# EAGLE design cdz7shld1 (EAGLE 9.6.2)

## Sheet 1 of 2
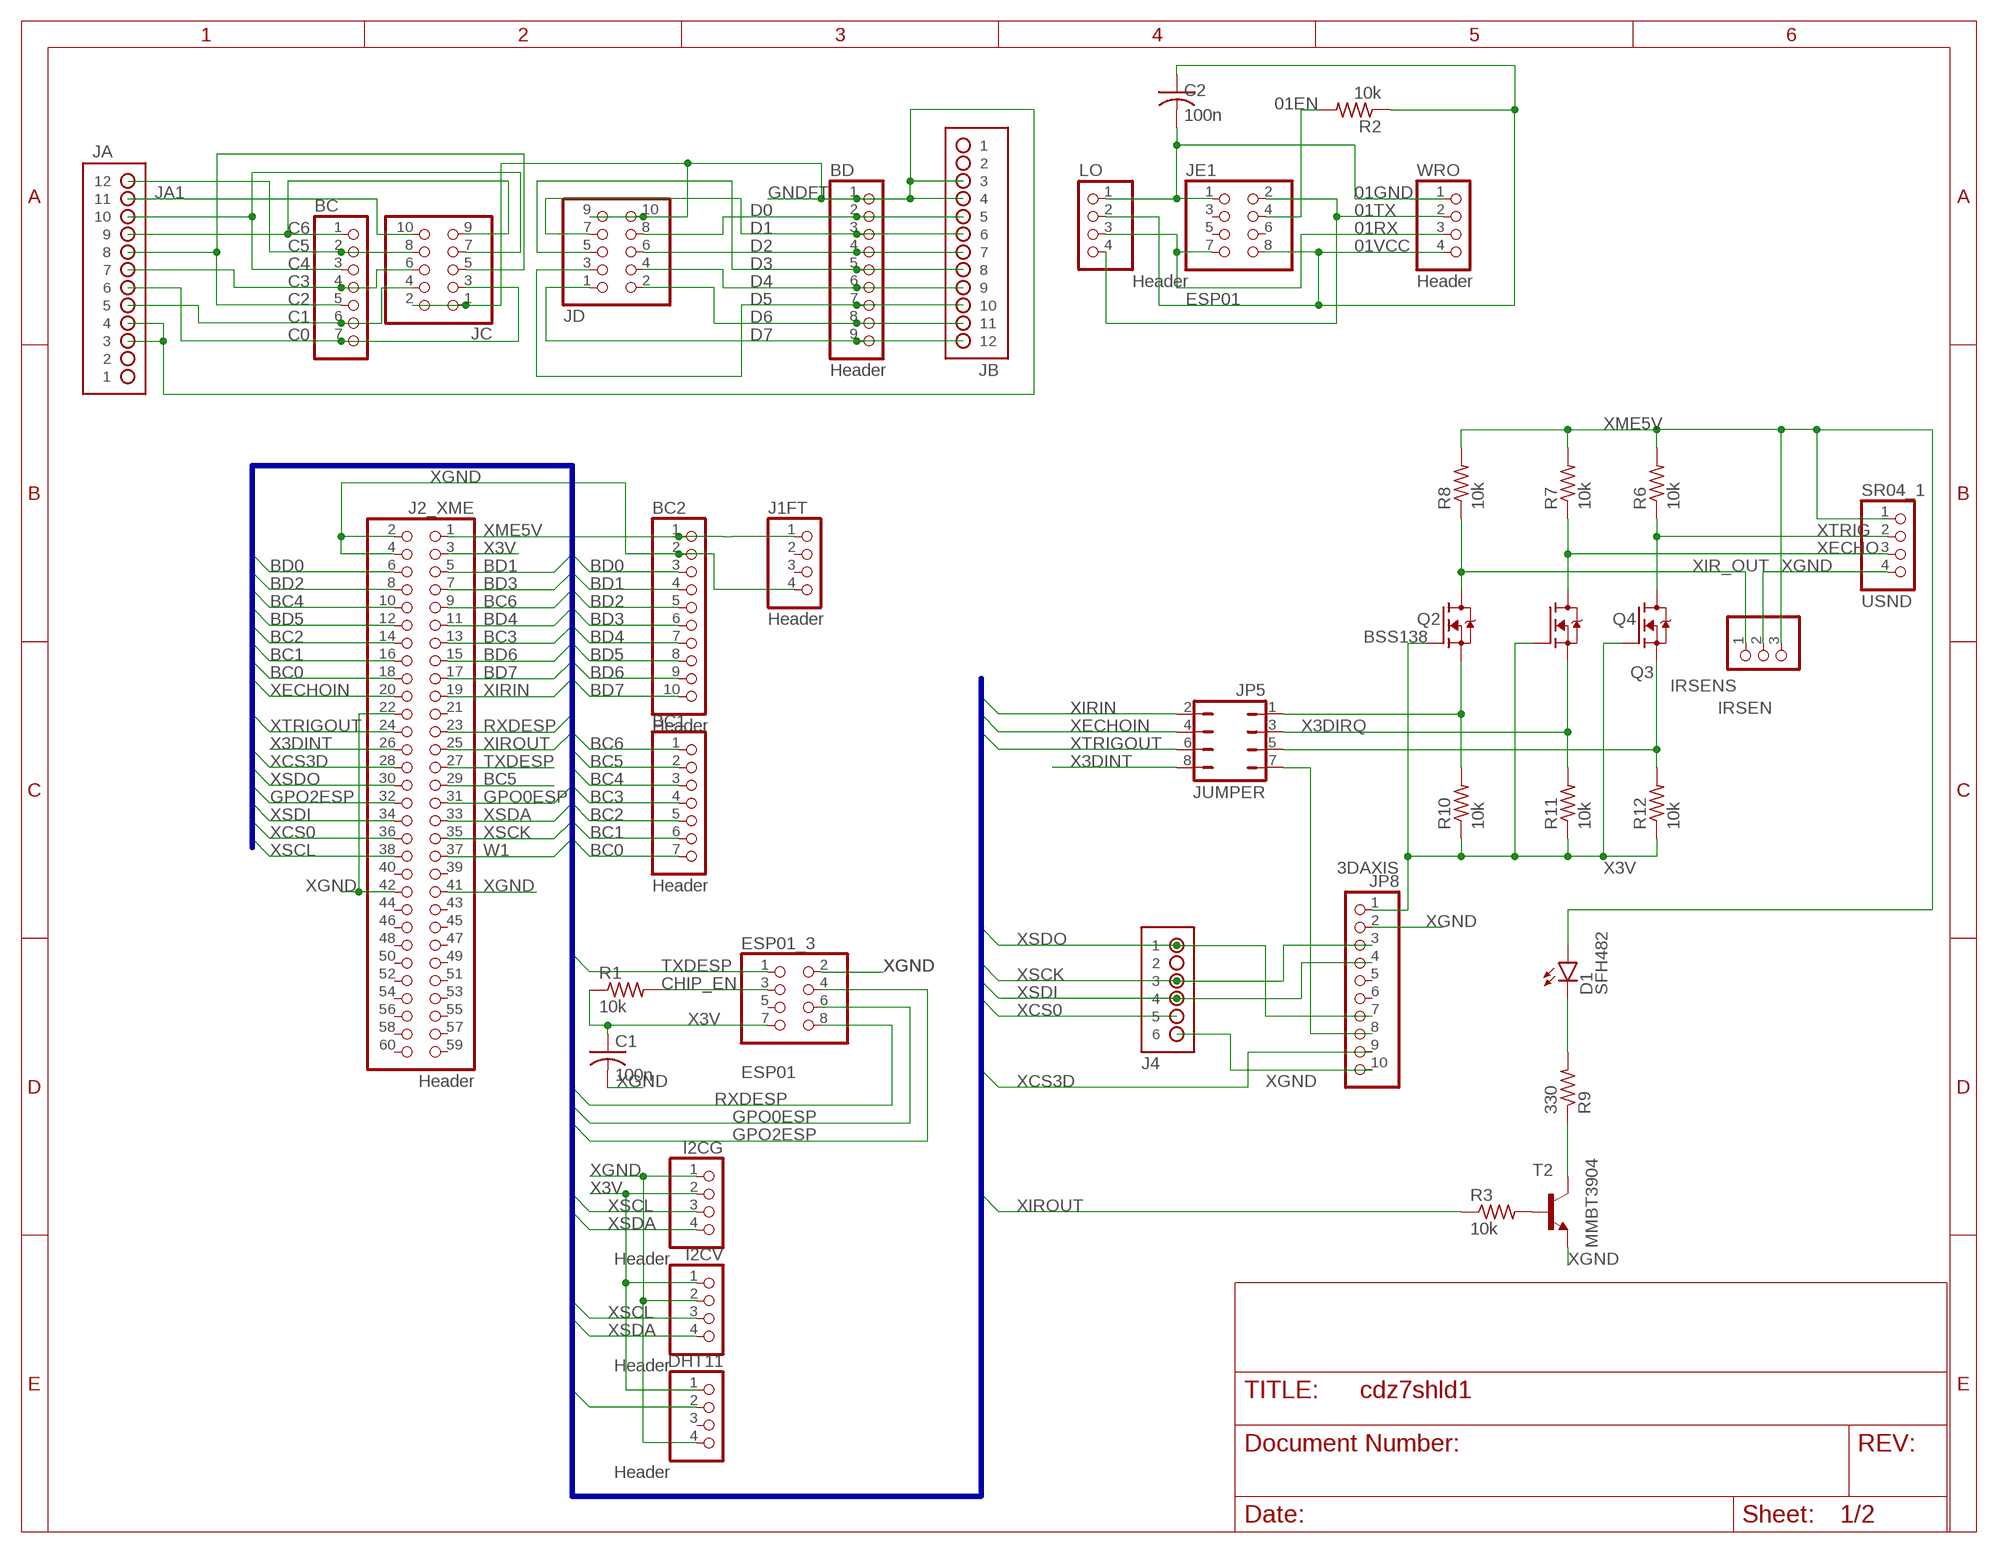
[diagram p0: schematic, sheet 1]

### Parts
BC  Header  PINHD-1X7  [1X07]
BC1  Header  PINHD-1X7  [1X07]
BC2  Header  PINHD-1X10  [1X10]
BD  Header  PINHD-1X9  [1X09]
C1  100n  C-USC0402  [C0402]
C2  100n  C-USC0402  [C0402]
D1  SFH482  [SFH482]
DHT11  Header  PINHD-1X4  [1X04]
ESP01_3  ESP01  PINHD-2X4  [2X04]
I2CG  Header  PINHD-1X4  [1X04]
I2CV  Header  PINHD-1X4  [1X04]
IRSENS  IRSEN  PINHD-1X3  [1X03]
J1FT  Header  PINHD-1X4  [1X04]
J2_XME  Header  PINHD-2X30  [2X30]
J4  HDR-2X3  [HDR-2X3]
JA  HDR-2X6  [HDR-2X6]
JB  HDR-2X6  [HDR-2X6]
JC  Header  PINHD-2X5  [2X05]
JD  Header  PINHD-2X5  [2X05]
JE1  ESP01  PINHD-2X4  [2X04]
JP5  JUMPER  JP4Q  [JP4Q]
JP8  3DAXIS  PINHD-1X10  [1X10]
LO  Header  PINHD-1X4  [1X04]
Q2  BSS138  [SOT23]
Q3  BSS138  [SOT23]
Q4  BSS138  [SOT23]
R1  10k  R-US_R0402  [R0402]
R2  10k  R-US_R0402  [R0402]
R3  10k  R-US_R0402  [R0402]
R6  10k  R-US_R0402  [R0402]
R7  10k  R-US_R0402  [R0402]
R8  10k  R-US_R0402  [R0402]
R9  330  R-US_R0402  [R0402]
R10  10k  R-US_R0402  [R0402]
R11  10k  R-US_R0402  [R0402]
R12  10k  R-US_R0402  [R0402]
SR04_1  USND  PINHD-1X4  [1X04]
T2  MMBT3904  MMBT3904LT1-NPN-SOT23-BEC  [SOT23-BEC]
WRO  Header  PINHD-1X4  [1X04]

### Nets
01EN: JE1.4 R2.2
01GND: C2.2 JE1.1 LO.1 WRO.1
01RX: JE1.7 LO.3 WRO.3
01TX: JE1.2 LO.4 WRO.2
01VCC: C2.1 JE1.8 LO.2 R2.1 WRO.4
BC0: BC1.7 J2_XME.18
BC1: BC1.6 J2_XME.16
BC2: BC1.5 J2_XME.14
BC3: BC1.4 J2_XME.13
BC4: BC1.3 J2_XME.10
BC5: BC1.2 J2_XME.29
BC6: BC1.1 J2_XME.9
BD0: BC2.3 J2_XME.6
BD1: BC2.4 J2_XME.5
BD2: BC2.5 J2_XME.8
BD3: BC2.6 J2_XME.7
BD4: BC2.7 J2_XME.11
BD5: BC2.8 J2_XME.12
BD6: BC2.9 J2_XME.15
BD7: BC2.10 J2_XME.17
C0: BC.7 JA.6 JC.3
C1: BC.6 JA.5 JC.4
C2: BC.5 JA.8 JC.5
C3: BC.4 JA.7 JC.6
C4: BC.3 JA.10 JC.7
C5: BC.2 JA.12 JC.8
C6: BC.1 JA.9 JC.9
CHIP_EN: ESP01_3.3 R1.2
D0: BD.2 JB.5 JD.8
D1: BD.3 JB.6 JD.7
D2: BD.4 JB.7 JD.6
D3: BD.5 JB.8 JD.5
D4: BD.6 JB.9 JD.4
D5: BD.7 JB.10 JD.3
D6: BD.8 JB.11 JD.2
D7: BD.9 JB.12 JD.1
GNDFT: BD.1 JA.3 JA.4 JB.3 JB.4 JC.1 JC.2 JD.9 JD.10
GPO0ESP: ESP01_3.6 J2_XME.31
GPO2ESP: ESP01_3.4 J2_XME.32
JA1: JA.11 JC.10
N$1: D1.K(C) R9.2
N$2: JP5.1 Q2.2(S) R10.2
N$4: R3.2 T2.B
N$11: JP5.3 Q3.2(S) R11.2
N$12: JP5.5 Q4.2(S) R12.2
N$17: R9.1 T2.C
RXDESP: ESP01_3.8 J2_XME.23
TXDESP: ESP01_3.1 J2_XME.27
W1: DHT11.2 J2_XME.37
X3DINT: J2_XME.26 JP5.8
X3DIRQ: JP5.7 JP8.8
X3V: C1.1 DHT11.1 ESP01_3.7 I2CG.2 I2CV.1 J2_XME.3 JP8.1 Q2.1(G) Q3.1(G) Q4.1(G) R1.1 R10.1 R11.1 R12.1
XCS0: J2_XME.36 J4.5
XCS3D: J2_XME.28 JP8.9
XECHO: Q3.3(D) R7.1 SR04_1.3
XECHOIN: J2_XME.20 JP5.4
XGND: BC2.2 C1.2 DHT11.4 ESP01_3.2 I2CG.1 I2CV.2 IRSENS.2 J1FT.4 J2_XME.2 J2_XME.4 J2_XME.22 J2_XME.41 J2_XME.42 J4.6 JP8.2 JP8.10 SR04_1.4 T2.E
XIR_OUT: IRSENS.1 Q2.3(D) R8.1
XIRIN: J2_XME.19 JP5.2
XIROUT: J2_XME.25 R3.1
XME5V: BC2.1 D1.A IRSENS.3 J1FT.1 J2_XME.1 R6.2 R7.2 R8.2 SR04_1.1
XSCK: J2_XME.35 J4.3 JP8.3
XSCL: I2CG.3 I2CV.3 J2_XME.38
XSDA: I2CG.4 I2CV.4 J2_XME.33
XSDI: J2_XME.34 J4.4 JP8.4
XSDO: J2_XME.30 J4.1 JP8.7
XTRIG: Q4.3(D) R6.1 SR04_1.2
XTRIGOUT: J2_XME.24 JP5.6
Unconnected: DHT11.3 ESP01_3.5 J1FT.2 J1FT.3 J2_XME.21 J2_XME.39 J2_XME.40 J2_XME.43 J2_XME.44 J2_XME.45 J2_XME.46 J2_XME.47 J2_XME.48 J2_XME.49 J2_XME.50 J2_XME.51 J2_XME.52 J2_XME.53 J2_XME.54 J2_XME.55 J2_XME.56 J2_XME.57 J2_XME.58 J2_XME.59 J2_XME.60 J4.2 JA.1 JA.2 JB.1 JB.2 JE1.3 JE1.5 JE1.6 JP8.5 JP8.6

### Buses
BC[0..6],BD[0..7],GPO0ESP,GPO2ESP,RXDESP,SCL,TXDESP,W1,XCS0,XCS3D,XECHOIN,XIRIN,XIROUT,XSCK,XSCL,XSDA,XSDI,XSDO,XTRIGOUT

## Sheet 2 of 2
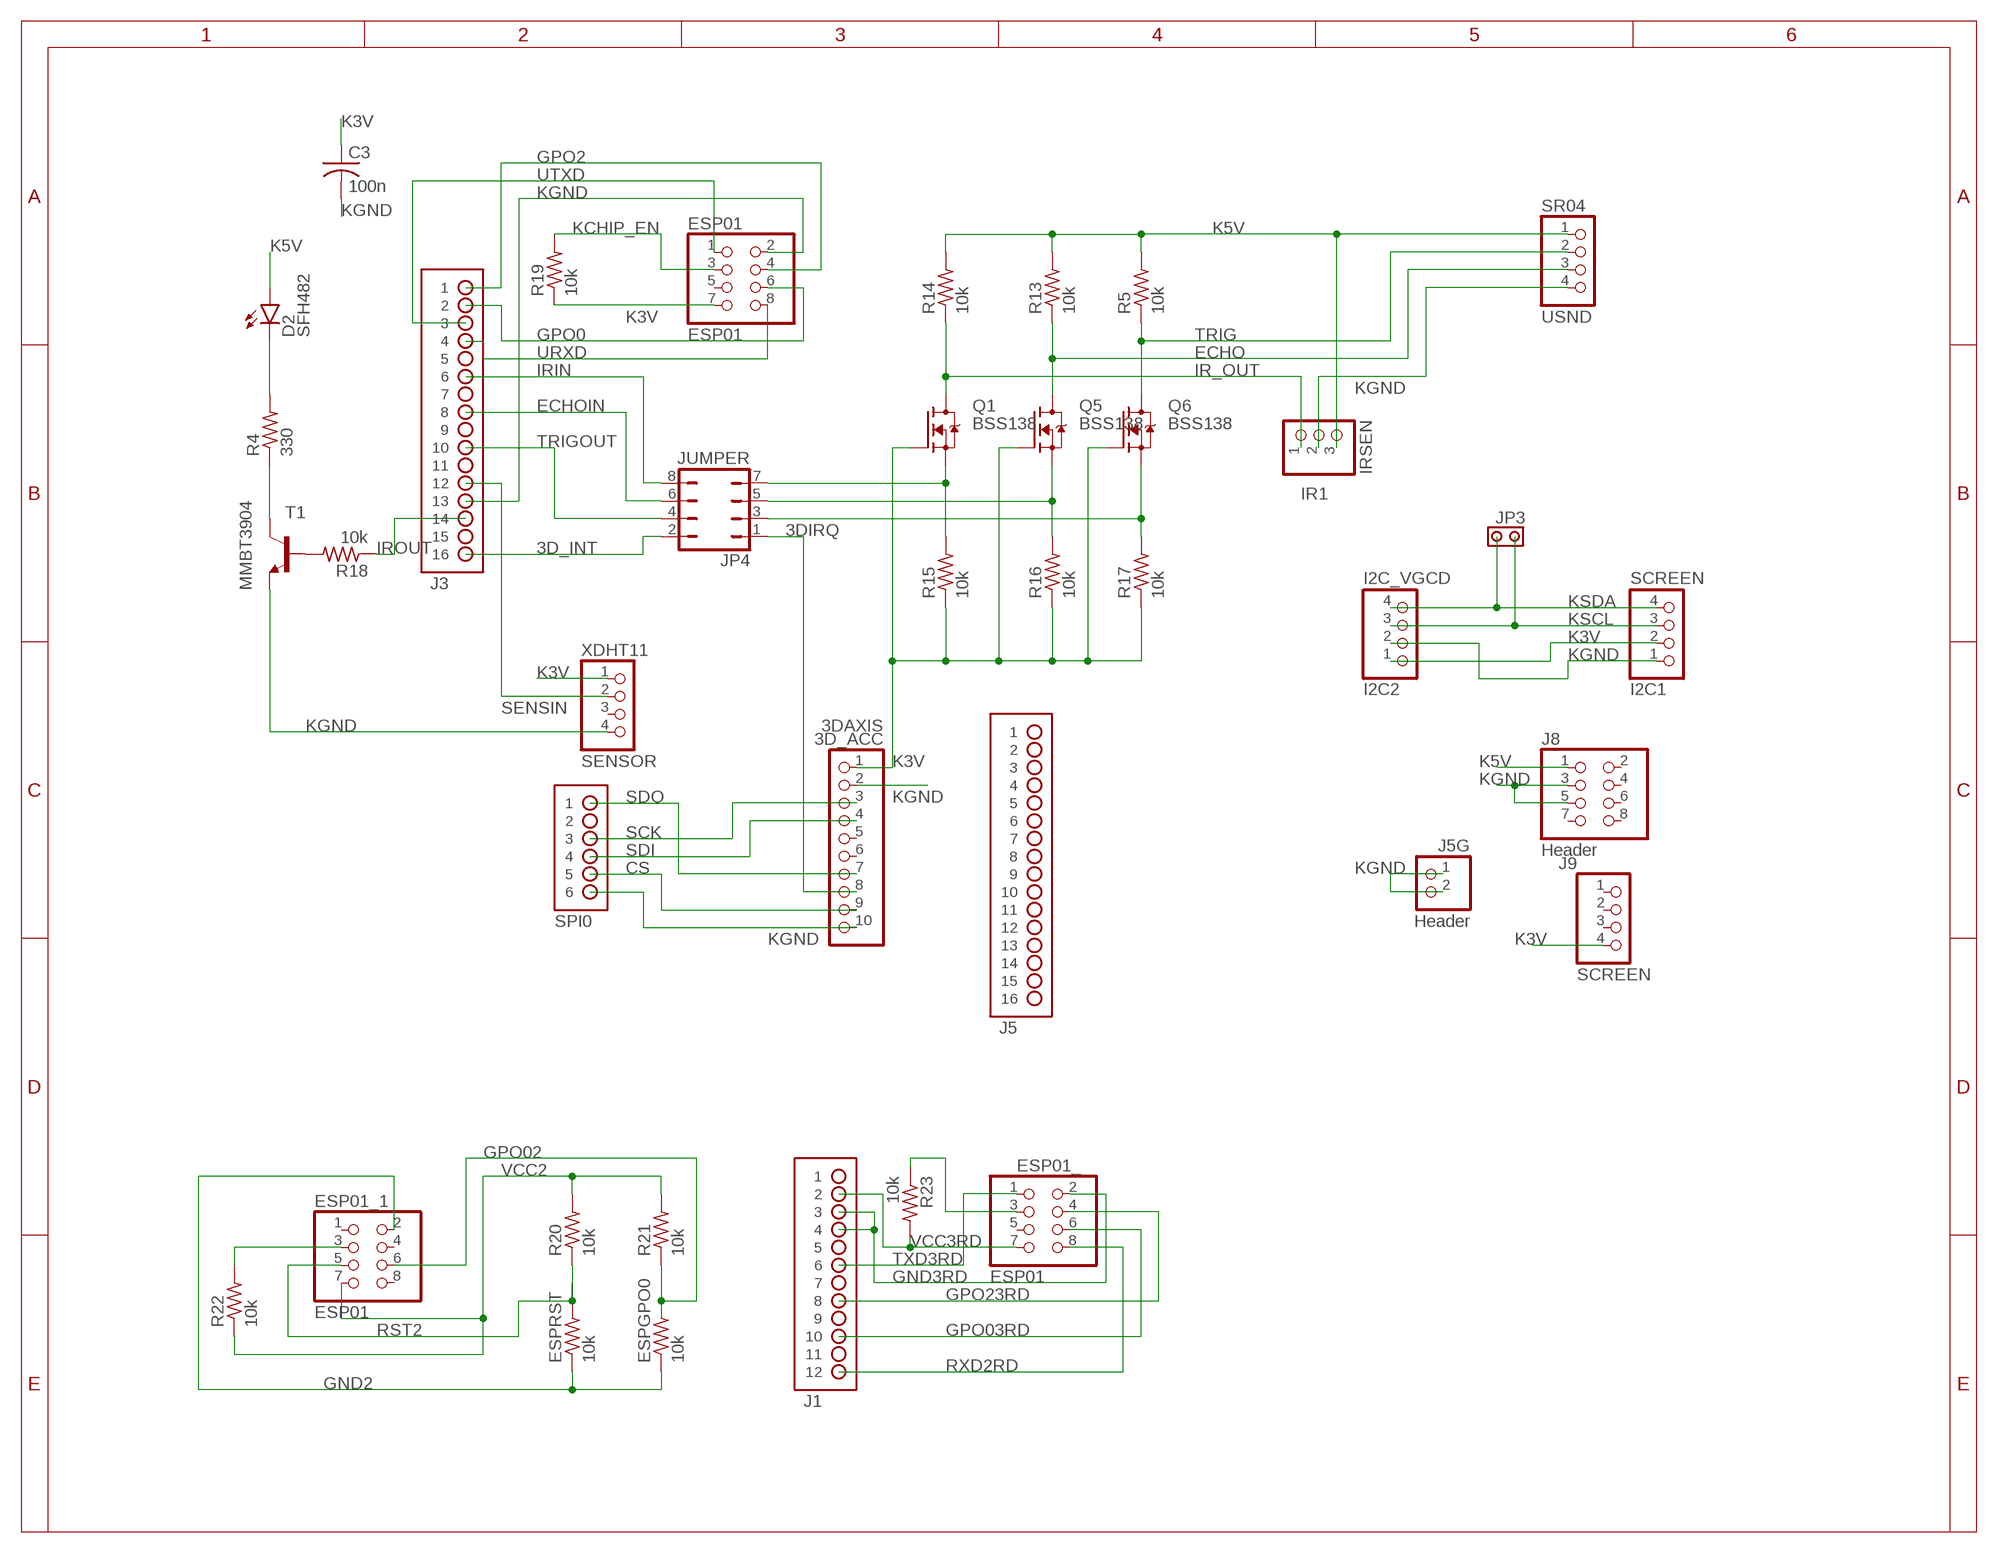
[diagram p1: schematic, sheet 2]

### Parts
3D_ACC  3DAXIS  PINHD-1X10  [1X10]
C3  100n  C-USC0402  [C0402]
D2  SFH482  [SFH482]
ESP01  ESP01  PINHD-2X4  [2X04]
ESP01_  ESP01  PINHD-2X4  [2X04]
ESP01_1  ESP01  PINHD-2X4  [2X04]
ESPGPO0  10k  R-US_0204/5  [0204/5]
ESPRST  10k  R-US_0204/5  [0204/5]
I2C1  SCREEN  PINHD-1X4  [1X04]
I2C2  I2C_VGCD  PINHD-1X4  [1X04]
IR1  IRSEN  PINHD-1X3  [1X03]
J1  HDR-2X6  [HDR-2X6]
J3  HDR-2X8  [HDR-2X8]
J5  HDR-2X8  [HDR-2X8]
J5G  Header  PINHD-1X2  [1X02]
J8  Header  PINHD-2X4  [2X04]
J9  SCREEN  PINHD-1X4  [1X04]
JP3  JPR-1X2  [JPR-1X2]
JP4  JUMPER  JP4Q  [JP4Q]
Q1  BSS138  [SOT23]
Q5  BSS138  [SOT23]
Q6  BSS138  [SOT23]
R4  330  R-US_R0402  [R0402]
R5  10k  R-US_R0402  [R0402]
R13  10k  R-US_R0402  [R0402]
R14  10k  R-US_R0402  [R0402]
R15  10k  R-US_R0402  [R0402]
R16  10k  R-US_R0402  [R0402]
R17  10k  R-US_R0402  [R0402]
R18  10k  R-US_R0402  [R0402]
R19  10k  R-US_R0402  [R0402]
R20  10k  R-US_R0402  [R0402]
R21  10k  R-US_R0402  [R0402]
R22  10k  R-US_R0402  [R0402]
R23  10k  R-US_R0402  [R0402]
SPI0  HDR-2X3  [HDR-2X3]
SR04  USND  PINHD-1X4  [1X04]
T1  MMBT3904  MMBT3904LT1-NPN-SOT23-BEC  [SOT23-BEC]
XDHT11  SENSOR  PINHD-1X4  [1X04]

### Nets
3D_INT: J3.16 JP4.2
3DIRQ: 3D_ACC.8 JP4.1
CS: 3D_ACC.9 SPI0.5
ECHO: Q5.3(D) R13.1 SR04.3
ECHOIN: J3.8 JP4.6
GND2: ESP01_1.2 ESPGPO0.1 ESPRST.1
GND3RD: ESP01_.2 J1.3 J1.4
GPO0: ESP01.6 J3.2
GPO2: ESP01.4 J3.1
GPO02: ESP01_1.6 ESPGPO0.2 R21.1
GPO03RD: ESP01_.6 J1.10
GPO23RD: ESP01_.4 J1.8
IR_OUT: IR1.1 Q1.3(D) R14.1
IRIN: J3.6 JP4.8
IROUT: J3.14 R18.1
K3V: 3D_ACC.1 C3.1 ESP01.7 I2C1.2 I2C2.1 J9.4 Q1.1(G) Q5.1(G) Q6.1(G) R15.1 R16.1 R17.1 R19.1 XDHT11.1
K5V: D2.A IR1.3 J8.1 R5.2 R13.2 R14.2 SR04.1
KCHIP_EN: ESP01.3 R19.2
KGND: 3D_ACC.2 3D_ACC.10 C3.2 ESP01.2 I2C1.1 I2C2.2 IR1.2 J3.13 J5G.1 J5G.2 J8.3 J8.5 SPI0.6 SR04.4 T1.E XDHT11.4
KSCL: I2C1.3 I2C2.3 JP3.2
KSDA: I2C1.4 I2C2.4 JP3.1
N$3: R4.1 T1.C
N$5: D2.K(C) R4.2
N$6: JP4.5 Q5.2(S) R16.2
N$7: JP4.3 Q6.2(S) R17.2
N$8: JP4.7 Q1.2(S) R15.2
N$9: R18.2 T1.B
N$10: ESP01_1.3 R22.2
N$13: ESP01_.3 R23.1
RST2: ESP01_1.5 ESPRST.2 R20.1
RXD2RD: ESP01_.8 J1.12
SCK: 3D_ACC.3 SPI0.3
SDI: 3D_ACC.4 SPI0.4
SDO: 3D_ACC.7 SPI0.1
SENSIN: J3.12 XDHT11.2
TRIG: Q6.3(D) R5.1 SR04.2
TRIGOUT: J3.10 JP4.4
TXD3RD: ESP01_.1 J1.6
URXD: ESP01.8 J3.4
UTXD: ESP01.1 J3.3
VCC2: ESP01_1.7 R20.2 R21.2 R22.1
VCC3RD: ESP01_.7 J1.2 R23.2
Unconnected: 3D_ACC.5 3D_ACC.6 ESP01.5 ESP01_1.1 ESP01_1.4 ESP01_1.8 ESP01_.5 J1.1 J1.5 J1.7 J1.9 J1.11 J3.5 J3.7 J3.9 J3.11 J3.15 J5.1 J5.2 J5.3 J5.4 J5.5 J5.6 J5.7 J5.8 J5.9 J5.10 J5.11 J5.12 J5.13 J5.14 J5.15 J5.16 J8.2 J8.4 J8.6 J8.7 J8.8 J9.1 J9.2 J9.3 SPI0.2 XDHT11.3

## Library data of the parts
3D_ACC BC2 JP8 = pinhead2:PINHD-1X10: PIN HEADER
BC BC1 = pinhead2:PINHD-1X7: PIN HEADER
BD = pinhead2:PINHD-1X9: PIN HEADER
C1-C3 = rcl:C-US: CAPACITOR, American symbol; SPICEPREFIX: C
D1 D2 = led:SFH482: IR LED infrared emitting diode, Infineon
DHT11 I2C1 I2C2 I2CG I2CV J1FT J9 LO SR04 SR04_1 WRO XDHT11 = pinhead2:PINHD-1X4: PIN HEADER
ESP01 ESP01_ ESP01_1 ESP01_3 JE1 = pinhead:PINHD-2X4: PIN HEADER
ESPGPO0 ESPRST R1-R23 = rcl:R-US_: RESISTOR, American symbol; SPICEPREFIX: R
IR1 IRSENS = pinhead2:PINHD-1X3: PIN HEADER
J1 JA JB = Mechanical:HDR-2X6: 2x6 header with 42mil holes and 100mil spacing
J2_XME = pinhead2:PINHD-2X30: PIN HEADER
J3 J5 = Mechanical:HDR-2X8: 100mil 2x8 header
J4 SPI0 = Mechanical:HDR-2X3
J5G = pinhead2:PINHD-1X2: PIN HEADER
J8 = pinhead2:PINHD-2X4: PIN HEADER
JC JD = pinhead2:PINHD-2X5: PIN HEADER
JP3 = Mechanical:JPR-1X2
JP4 JP5 = jumper:JP4Q: JUMPER
Q1-Q6 = bss138_10:BSS138: BSS138 N-Channel Logic Level Enhancement Mode Field Effect Transistor Source: http://www.fairchildsemi.com/datasheets/BS/BSS138.pdf; MF: Fairchild; MPN: BSS138; OC_FARNELL: 9845330; OC_NEWARK: 67R2009
T1 T2 = transistor:*-NPN-: NPN Transistror BF959 corrected 2008.03.06

## Board
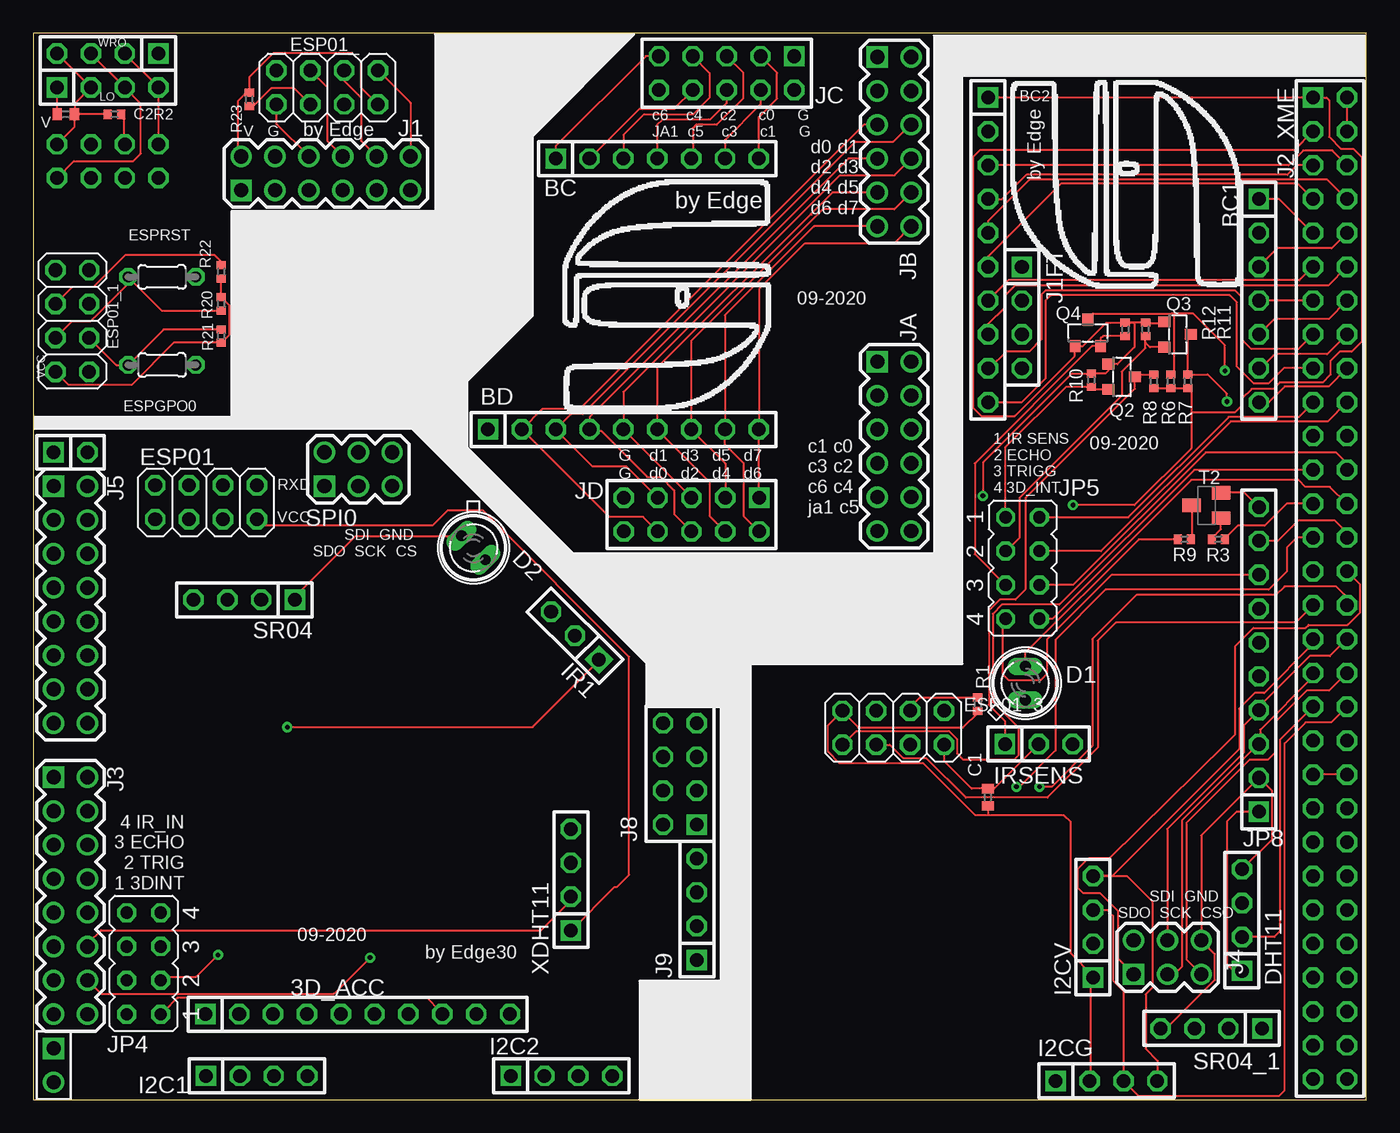
[diagram p2: board, top side]
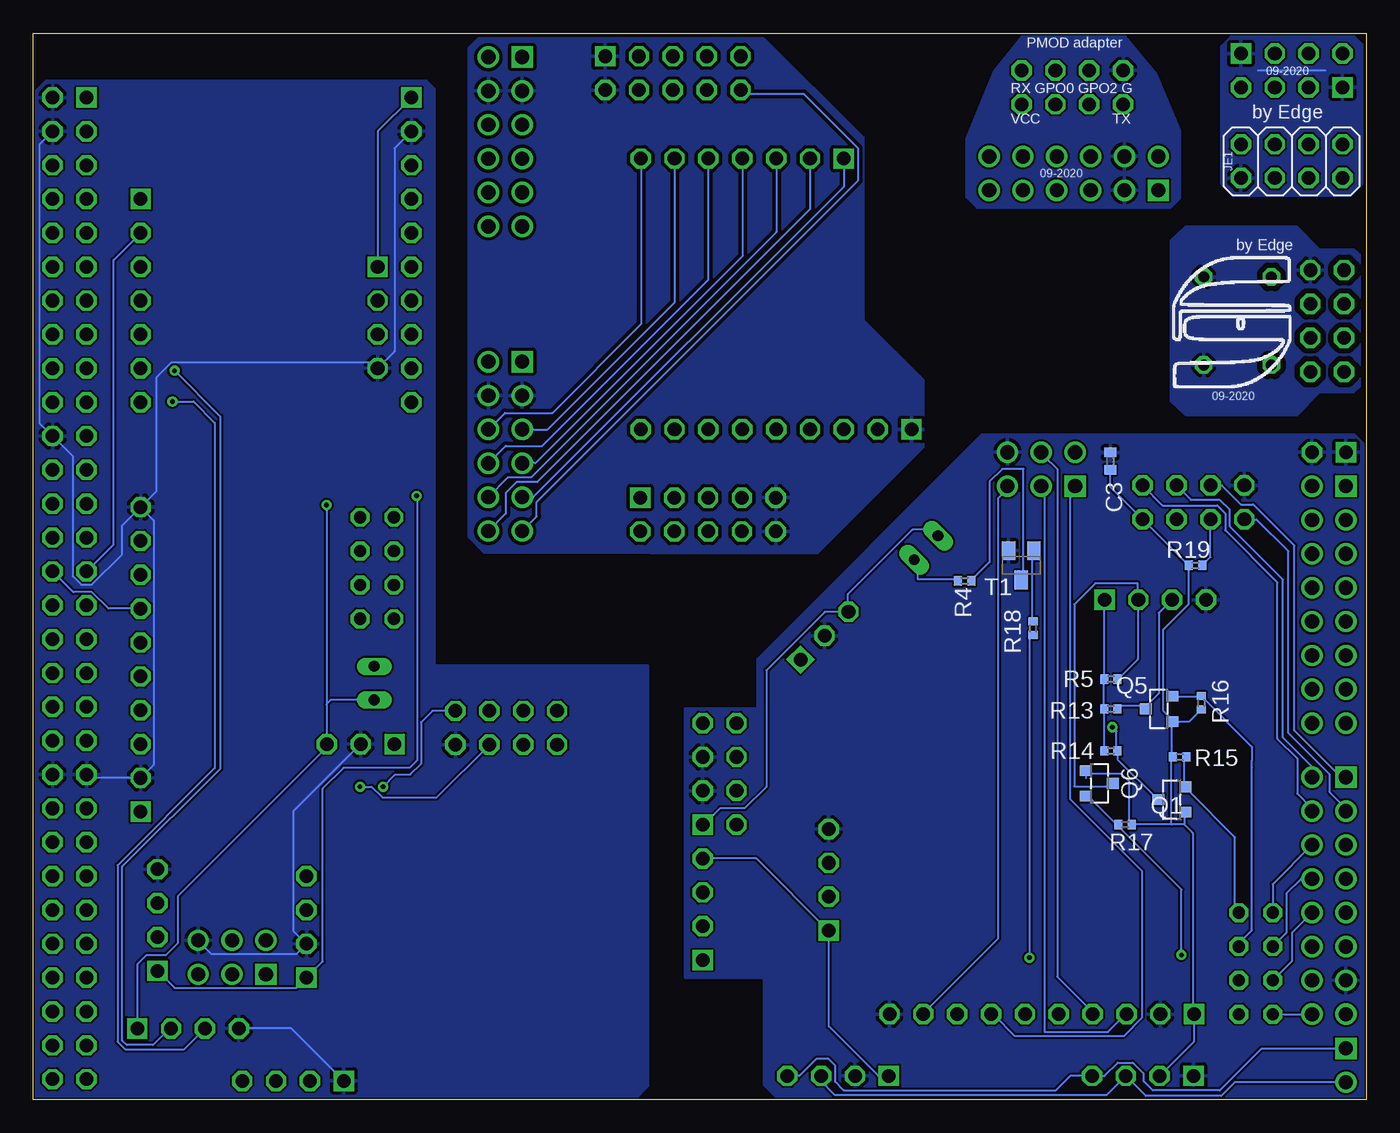
[diagram p3: board, bottom side, seen from below]

Size 100 x 80 mm. Coordinates in mm from the lower left corner, seen from the top.
Outline: 0,0 100,0 100,80 0,80 0,0
Copper layers (1*16): Top 0.035mm / dielectric 0.15mm / Bottom 0.035mm
Design rules "default *": minimum track width 6mil, minimum drill 0.35mm, track to track 6mil, track to pad 6mil, pad to pad 6mil, via to via 6mil, smd to smd 6mil, copper to edge 6mil, drill to drill 6mil, minimum pad ring 10mil, minimum via ring 8mil, stop-mask expansion 4mil, vias tented up to drill 0mil, thermal gap 10mil

### Footprints (pad centres in the part's own frame; a part is rotated, then mirrored left to right if it is on the bottom)
1X10 = drill 1.016 square: 1 -11.43,0 | drill 1.016 octagon: 2 -8.89,0; 3 -6.35,0; 4 -3.81,0; 5 -1.27,0; 6 1.27,0; 7 3.81,0; 8 6.35,0; 9 8.89,0; 10 11.43,0
1X07 = drill 1.016 square: 1 -7.62,0 | drill 1.016 octagon: 2 -5.08,0; 3 -2.54,0; 4 0,0; 5 2.54,0; 6 5.08,0; 7 7.62,0
1X09 = drill 1.016 square: 1 -10.16,0 | drill 1.016 octagon: 2 -7.62,0; 3 -5.08,0; 4 -2.54,0; 5 0,0; 6 2.54,0; 7 5.08,0; 8 7.62,0; 9 10.16,0
C0402 = smd 0.7 x 0.9: 1 -0.65,0; 2 0.65,0
SFH482 = drill 0.813 long: A -1.27,0; K 1.27,0
1X04 = drill 1.016 square: 1 -3.81,0 | drill 1.016 octagon: 2 -1.27,0; 3 1.27,0; 4 3.81,0
2X04 = drill 1.016 octagon: 1 -3.81,-1.27; 2 -3.81,1.27; 3 -1.27,-1.27; 4 -1.27,1.27; 5 1.27,-1.27; 6 1.27,1.27; 7 3.81,-1.27; 8 3.81,1.27
0204/5 = drill 0.813 octagon: 1 -2.54,0; 2 2.54,0
1X03 = drill 1.016 square: 1 -2.54,0 | drill 1.016 octagon: 2 0,0; 3 2.54,0
HDR-2X6 = drill 1.067 square: 1 -1.27,6.35 | drill 1.067: 2 1.27,6.35; 3 -1.27,3.81; 4 1.27,3.81; 5 -1.27,1.27; 6 1.27,1.27; 7 -1.27,-1.27; 8 1.27,-1.27; 9 -1.27,-3.81; 10 1.27,-3.81; 11 -1.27,-6.35; 12 1.27,-6.35
2X30 = drill 1.016 square: 1 -38.1,-1.27 | drill 1.016 octagon: 2 -38.1,1.27; 3 -35.56,-1.27; 4 -35.56,1.27; 5 -33.02,-1.27; 6 -33.02,1.27; 7 -30.48,-1.27; 8 -30.48,1.27; 9 -27.94,-1.27; 10 -27.94,1.27; 11 -25.4,-1.27; 12 -25.4,1.27; 13 -22.86,-1.27; 14 -22.86,1.27; 15 -20.32,-1.27; 16 -20.32,1.27; 17 -17.78,-1.27; 18 -17.78,1.27; 19 -15.24,-1.27; 20 -15.24,1.27; 21 -12.7,-1.27; 22 -12.7,1.27; 23 -10.16,-1.27; 24 -10.16,1.27; 25 -7.62,-1.27; 26 -7.62,1.27; 27 -5.08,-1.27; 28 -5.08,1.27; 29 -2.54,-1.27; 30 -2.54,1.27; 31 0,-1.27; 32 0,1.27; 33 2.54,-1.27; 34 2.54,1.27; 35 5.08,-1.27; 36 5.08,1.27; 37 7.62,-1.27; 38 7.62,1.27; 39 10.16,-1.27; 40 10.16,1.27; 41 12.7,-1.27; 42 12.7,1.27; 43 15.24,-1.27; 44 15.24,1.27; 45 17.78,-1.27; 46 17.78,1.27; 47 20.32,-1.27; 48 20.32,1.27; 49 22.86,-1.27; 50 22.86,1.27; 51 25.4,-1.27; 52 25.4,1.27; 53 27.94,-1.27; 54 27.94,1.27; 55 30.48,-1.27; 56 30.48,1.27; 57 33.02,-1.27; 58 33.02,1.27; 59 35.56,-1.27; 60 35.56,1.27
HDR-2X8 = drill 1.067 square: 1 -1.27,8.89 | drill 1.067: 2 1.27,8.89; 3 -1.27,6.35; 4 1.27,6.35; 5 -1.27,3.81; 6 1.27,3.81; 7 -1.27,1.27; 8 1.27,1.27; 9 -1.27,-1.27; 10 1.27,-1.27; 11 -1.27,-3.81; 12 1.27,-3.81; 13 -1.27,-6.35; 14 1.27,-6.35; 15 -1.27,-8.89; 16 1.27,-8.89
HDR-2X3 = drill 1.067 square: 1 -1.27,2.54 | drill 1.067: 2 1.27,2.54; 3 -1.27,0; 4 1.27,0; 5 -1.27,-2.54; 6 1.27,-2.54
1X02 = drill 1.016 square: 1 -1.27,0 | drill 1.016 octagon: 2 1.27,0
2X04' = drill 1.016 square: 1 -3.81,-1.27 | drill 1.016 octagon: 2 -3.81,1.27; 3 -1.27,-1.27; 4 -1.27,1.27; 5 1.27,-1.27; 6 1.27,1.27; 7 3.81,-1.27; 8 3.81,1.27
2X05 = drill 1.016 square: 1 -5.08,-1.27 | drill 1.016 octagon: 2 -5.08,1.27; 3 -2.54,-1.27; 4 -2.54,1.27; 5 0,-1.27; 6 0,1.27; 7 2.54,-1.27; 8 2.54,1.27; 9 5.08,-1.27; 10 5.08,1.27
JPR-1X2 = drill 1.067 square: 1 0,1.27 | drill 1.067: 2 0,-1.27
JP4Q = drill 0.914 octagon: 1 -3.81,-1.27; 2 -3.81,1.27; 3 -1.27,-1.27; 4 -1.27,1.27; 5 1.27,-1.27; 6 1.27,1.27; 7 3.81,-1.27; 8 3.81,1.27
SOT23 = smd 0.8 x 0.9: 1 -0.95,-1; 2 0.95,-1; 3 0,1
R0402 = smd 0.6 x 0.7: 1 -0.5,0; 2 0.5,0
SOT23-BEC = smd 1 x 1.4: B -0.95,-1.1; C 0,1.1; E 0.95,-1.1

### Placement (x,y rotation side)
3D_ACC  24.33,6.4 0 top
BC  46.81,70.6 0 top
BC1  91.95,59.94 270 top
BC2  71.63,63.75 270 top
BD  44.27,50.28 0 top
C1  71.6,22.68 90 top
C2  2.44,73.91 180 top
C3  19.2,47.9 90 bottom
D1  74.42,31.24 90 top
D2  33.02,41.4 315 top
DHT11  90.68,13.46 90 top
ESP01  12.95,44.81 0 top
ESP01_  22.05,75.95 0 top
ESP01_1  2.92,58.42 270 top
ESP01_3  64.52,27.89 180 top
ESPGPO0  9.65,55.12 180 top
ESPRST  9.65,61.72 180 top
I2C1  16.76,1.78 0 top
I2C2  39.62,1.78 0 top
I2CG  80.52,1.4 0 top
I2CV  79.5,12.95 90 top
IR1  40.64,34.8 135 top
IRSENS  75.44,26.67 0 top
J1  21.95,69.49 90 top
J1FT  74.17,58.67 270 top
J2_XME  97.28,37.08 270 top
J3  2.79,15.29 0 top
J4  85.09,10.67 90 top
J5  2.79,37.13 0 top
J5G  2.79,48.56 0 top
J8  Header  [2X04']  48.51,24.43 90 top
J9  49.78,14.27 90 top
JA  64.59,49.01 0 top
JB  64.59,71.87 0 top
JC  52.02,77.01 180 top
JD  49.38,43.89 180 top
JE1  5.59,70.41 0 bottom
JP3  1.52,2.57 0 top
JP4  8.28,10.21 90 top
JP5  74.22,39.88 270 top
JP8  91.95,33.02 90 top
LO  5.59,75.95 0 top
Q1  14.58,22.5 90 bottom
Q2  81.66,54.23 270 top
Q3  85.85,57.4 270 top
Q4  79.12,57.53 0 top
Q5  15.54,29.31 90 bottom
Q6  20.02,23.72 270 bottom
R1  70.85,29.67 90 top
R2  6.1,73.91 0 top
R3  88.9,42.04 180 top
R4  30.12,38.91 180 bottom
R5  19.15,31.55 180 bottom
R6  85.34,53.9 270 top
R7  86.61,53.9 270 top
R8  84.07,53.9 270 top
R9  86.36,42.04 180 top
R10  79.38,53.98 270 top
R11  83.44,57.78 270 top
R12  81.92,57.78 270 top
R13  19.15,29.31 180 bottom
R14  19.15,26.16 180 bottom
R15  14,25.7 0 bottom
R16  12.37,29.77 90 bottom
R17  18.08,20.62 180 bottom
R18  24.99,35.36 90 bottom
R19  12.8,40.08 0 bottom
R20  14.1,59.69 90 top
R21  14.1,57.28 270 top
R22  14.1,62.1 90 top
R23  16.21,75.03 90 top
SPI0  24.38,47.29 90 top
SR04  15.82,37.49 180 top
SR04_1  88.39,5.33 180 top
T1  25.88,40.08 180 bottom
T2  88.01,44.58 90 top
WRO  5.59,78.49 180 top
XDHT11  40.34,16.48 90 top

### Tracks (layer width: path | path; a pad name or v marks a point on that pad's centre or on a via)
01EN
  Top 0.152: R2.2 6.8,73.71 6.8,71.74 JE1.4
01GND
  Top 0.152: C2.2 1.79,75.94 LO.1
  Bottom 0.152: 8.13,77.22 3.05,77.22
  pour Bottom: 10.01,67.82 1.17,67.82 0.25,68.73 0.25,79.15 0.86,79.76 10.16,79.76 10.92,78.99 10.92,68.73
01RX
  Top 0.152: WRO.3 LO.3 8.07,74.73 8.07,70.99 7.5,70.41 3.05,70.41 JE1.7
01TX
  Top 0.152: WRO.2 LO.4 JE1.2
01VCC
  Top 0.152: WRO.4 LO.2 3.09,74.72 C2.1 | JE1.8 3.09,72.99 C2.1 | R2.1 C2.1
3D_INT
  Bottom 0.152: JP4.2 J3.16
3DIRQ
  Top 0.152: JP4.1 9.84,6.67 10.79,7.62 29.53,7.62 30.48,6.67 3D_ACC.8
BC0
  Top 0.152: J2_XME.18 97.19,53.5 93.88,53.5 92.71,52.32 BC1.7
BC1
  Top 0.152: J2_XME.16 97.07,55.92 93.15,55.92 92.1,54.86 BC1.6
BC2
  Top 0.152: J2_XME.14 97.18,58.57 93.12,58.57 BC1.5
BC3
  Top 0.152: J2_XME.13 BC1.4
BC4
  Top 0.152: J2_XME.10 97.41,63.88 93.34,63.88 BC1.3
BC5
  Bottom 0.152: J2_XME.29 93.98,41.66 93.98,62.99 BC1.2
BC6
  Top 0.152: J2_XME.9 93.47,67.56 BC1.1
BD0
  Top 0.152: J2_XME.6 97.46,71.2 95.28,71.2 94.18,70.1 BC2.3
BD1
  Top 0.152: J2_XME.5 94.79,70.1 94.08,69.39 74.5,69.39 72.67,67.56 BC2.4
BD2
  Top 0.152: J2_XME.8 97.1,69.02 74.73,69.02 71.63,65.91 BC2.5
BD3
  Top 0.152: J2_XME.7 94.87,68.71 77.09,68.71 71.63,63.25 BC2.6
BD4
  Top 0.152: J2_XME.11 95,61.47 73.15,61.47 BC2.7
BD5
  Top 0.152: J2_XME.12 97.16,61.09 73.66,61.09 72.9,60.33 72.9,59.44 71.63,58.17 BC2.8
BD6
  Top 0.152: BC2.9 71.73,54.86 73,56.13 74.73,56.13 75.64,57.05 75.64,60.4 75.95,60.71 90.17,60.71 90.68,60.2 90.68,57.02 91.39,56.31 94.92,56.31 J2_XME.15
BD7
  Top 0.152: J2_XME.17 93.8,54.86 92.67,53.73 91.55,53.73 90.3,54.99 90.3,59.82 89.76,60.35 76.35,60.35 75.95,59.94 75.95,54.1 74.17,52.32 BC2.10
C0
  Top 0.152: BC.7 54.43,73.72 55.8,75.1 55.8,77.04 JC.3
  Bottom 0.152: BC.7 54.41,70.57 54.41,58.18 61.06,51.52 64.62,51.52 JA.6
C1
  Top 0.152: BC.6 51.89,72 54.56,74.66 JC.4
  Bottom 0.152: BC.6 51.89,59.8 61.42,50.28 JA.5
C2
  Top 0.152: BC.5 49.48,70.73 49.48,72.89 49.73,73.14 51.26,73.14 53.26,75.15 53.26,77.04 JC.5
  Bottom 0.152: 49.45,70.55 BC.5 49.35,61.52 61.83,49.05 64.55,49.05 JA.8
C3
  Top 0.152: BC.4 46.81,73.14 47.19,73.52 50.79,73.52 52.02,74.75 JC.6
  Bottom 0.152: JA.7 62.33,47.74 46.8,63.27 46.81,63.28 BC.4
C4
  Top 0.152: BC.3 44.27,72.38 45.8,73.9 49.48,73.9 50.75,75.17 50.75,77.01 JC.7
  Bottom 0.152: BC.3 44.25,70.57 44.25,65.09 62.64,46.7 64.36,46.7 JA.10
C5
  Top 0.152: BC.2 45.45,74.31 48.11,74.31 48.11,74.38 JC.8
  Bottom 0.152: BC.2 41.73,66.79 62.19,46.33 63.75,46.33 64.55,45.52 64.55,43.97 JA.12
C6
  Top 0.152: JC.9 45.96,78.28 39.19,71.51 BC.1
  Bottom 0.152: BC.1 39.19,68.51 62.5,45.2 JA.9
CHIP_EN
  Top 0.152: ESP01_3.3 65.79,29.44 66.49,30.15 70.84,30.15 R1.2
CS
  Bottom 0.152: 3D_ACC.9 33.02,6.67 27.62,12.06 27.62,45.09 26.99,45.72 SPI0.5
D0
  Top 0.152: JB.5 62.31,73.14 40.97,51.8 38.18,51.8 BD.2 43.22,43.71 45.75,43.71 JD.8
D1
  Top 0.152: JB.6 65.8,73.14 64.53,71.87 61.67,71.87 41.22,51.42 40.34,51.42 BD.3 41.97,47.5 44.5,47.5 JD.7
  Bottom 0.152: BD.3 39.19,50.48
D2
  Top 0.152: JD.6 48.08,43.92 48.08,45.71 47.1,46.69 46.08,46.69 42.62,50.15 41.86,50.15 BD.4 41.73,51.19 61.14,70.6 JB.7
D3
  Top 0.152: JB.8 64.62,69.36 60.53,69.36 44.27,53.1 BD.5 | 44.65,50.28 BD.5 | BD.5 49.38,45.17 JD.5
D4
  Top 0.152: JB.9 59.95,68.06 58.33,66.44 | 58.33,66.44 46.81,54.93 BD.6 50.75,46.34 50.75,43.79 JD.4 | 58.33,66.44 58.39,66.38
  Bottom 0.152: 46.86,50.28 BD.6
D5
  Top 0.152: JB.10 64.59,66.79 59.23,66.79 49.35,56.91 BD.7 51.92,47.71 JD.3
D6
  Top 0.152: JB.11 58.57,65.52 51.89,58.84 BD.8 51.89,49.14 53.29,47.74 53.29,43.79 JD.2
D7
  Top 0.152: 54.46,50.25 BD.9 54.48,50.28 | 54.48,50.28 54.48,60.85 57.87,64.23 64.57,64.23 JB.12 | JD.1 54.46,50.25 | 54.46,50.25 54.48,50.28
ECHO
  Bottom 0.152: R13.1 18.41,29.53 16.83,29.53 Q5.3 16.51,29.53 15.56,30.48 15.56,36.51 14.61,37.47 SR04.3
ECHOIN
  Bottom 0.152: J3.8 4.88,16.56 5.99,15.45 5.99,12.51 JP4.6
GND2
  pour Bottom (isolate 0.406): 14.71,64.44 14.71,52.41 13.56,51.36 5.18,51.36 3.47,53.07 0.91,53.07 0.09,53.81 0.09,63.04 0.91,63.78 3.47,63.78 5.18,65.49 13.56,65.49
GND3RD
  pour Bottom: 14.71,66.88 29.18,66.88 30,67.69 30,72.11 27.92,77.14 25.78,79.78 18.09,79.78 15.73,76.92 14,72.73 14,67.59
GNDFT
  pour Bottom (isolate 0.254): 45.44,79.89 66.41,79.85 67.39,78.87 67.39,42.24 66.2,41.06 41.18,40.98 33.2,48.97 33.2,53.99 37.67,58.46 37.67,72.17
GPO0
  Bottom 0.152: ESP01.6 13.13,44.98 10.96,44.98 10.24,44.25 10.24,43 6.25,39.01 6.25,27.18 4.06,24.99 J3.2
GPO0ESP
  Top 0.152: J2_XME.31 94.72,35.79 81.2,35.79 79.86,34.44 79.86,26.42 76.1,22.66 69.95,22.66 67,25.6 65.28,25.6 64.26,26.62 ESP01_3.6
GPO2
  Bottom 0.152: ESP01.4 10.82,46.08 9.4,44.65 8.48,44.65 5.39,41.56 5.39,27.69 1.88,24.18 J3.1
GPO02
  Top 0.152: ESP01_1.6 6.22,55.12 ESPGPO0.2 9.77,57.78 R21.1
GPO2ESP  (via drill 0.35)
  Top 0.152: J2_XME.32 98.55,37.69 97.74,38.51 93.88,38.51 93.22,37.85 82.75,37.85 79.45,34.54 79.45,26.52 76.4,23.47 v75.49,23.47
  Bottom 0.152: v75.49,23.47 74.62,23.47 73.81,22.66 69.75,22.66 ESP01_3.4
GPO03RD
  Top 0.152: ESP01_.6 23.32,76.45 24.59,75.18 24.59,71.93 J1.10
GPO23RD
  Top 0.152: ESP01_.4 22.05,75.95 22.05,71.93 J1.8
IR_OUT  (via drill 0.35)
  Top 0.152: v19.05,27.94 37.47,27.94 42.23,32.7 IR1.1
  Bottom 0.152: 15.88,22.54 Q1.3 15.64,22.51 18.65,25.53 R14.1 18.73,26.38 18.73,27.62 v19.05,27.94
IRIN
  Bottom 0.152: J3.6 7.01,16.15 JP4.8
IROUT  (via drill 0.35)
  Top 0.152: v25.27,10.64 22.57,7.94 5.08,7.94 4.13,8.89 J3.14
  Bottom 0.152: R18.1 25.27,34.58 v25.27,10.64
JA1
  Bottom 0.152: JA.11 62.23,43.75 62.23,44.84 38.1,68.97 38.1,71.35 42.18,75.44 46.63,75.44 JC.10
K3V
  Top 0.152: ESP01.7 16.76,43.28 16.97,43.08 29.97,43.08 31.09,44.2 33.73,44.2 44.7,33.22 44.7,16.87 43.79,15.95 43.61,15.95 XDHT11.1
  Bottom 0.152: J9.4 45.74,18.09 XDHT11.1 40.31,12.65 40.31,5.48 36.6,1.78 I2C2.1 | ESP01.7 16.79,43.56 | 16.79,43.56 19.2,45.97 C3.1 | 16.79,43.56 16.78,43.56 R19.1 13.34,40.01 13.34,37.15 15.24,35.24 15.24,29.21 14.61,28.57 Q5.1 | I2C1.2 12.9,4.37 3D_ACC.1 13.02,6.67 13.02,20 13.65,20.64 | 21.02,24.11 Q6.1 20.95,24.45 18.35,24.45 17.78,23.88 17.78,20.64 R17.1 | 17.59,20.68 R17.1 | 14.45,28.46 Q5.1 | 14.49,28.31 Q5.1 | 14.29,28.57 Q5.1 | Q5.1 14.61,28.26 14.61,25.72 R15.1 14.61,25.4 14.61,20.64 | 13.65,20.64 14.61,20.64 | 14.61,20.64 17.46,20.64 R17.1 | 13.65,20.64 13.65,21.27 Q1.1 | Q5.1 13.28,28.36 R16.1
K5V
  Top 0.152: D2.A | SR04.1 19.68,37.78 24.13,42.23 32.07,42.23 D2.A
  Bottom 0.152: J8.1 49.68,20.62 48.46,21.84 46.63,21.84 45.01,23.47 45.01,32.21 40.62,36.59 IR1.3 38.91,36.66 38.91,37.9 34.04,42.77 32.59,42.77 D2.A | 19.63,31.56 R5.2 | D2.A | R14.2 19.68,26.38 19.68,29.21 R13.2 19.68,29.53 19.68,31.43 R5.2 | R5.2 19.68,31.75 19.68,37.47 SR04.1
KCHIP_EN
  Bottom 0.152: R19.2 11.68,40.7 ESP01.3
KGND
  Bottom 0.152: 4.27,48.56 J5G.2
  pour Bottom (isolate 0.152): 0,0 0,49.02 0.86,49.89 28.85,49.89 45.72,33.02 45.72,29.34 51.13,29.34 51.13,9.14 45.21,9.14 45.21,1.12 44.09,0
KSCL
  Bottom 0.152: I2C2.3 41,1.68 41,1.47 39.88,0.36 19.46,0.36 I2C1.3 16.54,0.28 10.88,0.28 9.86,1.29 JP3.2
KSDA
  Bottom 0.152: I2C2.4 42.52,1.78 41.25,3.05 40.34,3.05 39.83,2.54 39.83,1.32 39.22,0.71 23.27,0.71 22.2,1.78 I2C1.4 19.64,1.78 18.65,2.77 17.52,2.77 16.69,1.93 16.69,1.37 16.01,0.69 11,0.69 7.85,3.83 JP3.1
N$1
  Top 0.152: D1.K 74.42,33.53 82.93,42.04 R9.2
N$2
  Top 0.152: JP5.1 72.95,48.94 77.48,53.48 R10.2 79.57,53.28 Q2.2
N$3
  Bottom 0.152: R4.1 29.53,39.05 28.26,40.32 28.26,46.35 27.3,47.31 25.72,47.31 25.72,39.05 T1.C
N$4
  Top 0.152: 89.16,43.31 T2.B 89.11,42.8 88.4,42.09 R3.2
N$5
  Bottom 0.152: R4.2 30.8,39.05 33.66,39.05 33.66,40.32 D2.K
N$6
  Bottom 0.152: JP4.5 9.53,11.75 8.57,12.7 8.57,24.89 8.57,25.44 8.57,26.47 R16.2 Q5.2
N$7  (via drill 0.35)
  Top 0.152: v13.86,10.85 12.22,9.21 9.84,9.21 JP4.3
  Bottom 0.152: Q6.2 20.95,22.86 18.73,20.64 R17.2 18.41,20.32 13.86,15.76 v13.86,10.85
N$8
  Bottom 0.152: Q1.2 13.53,23.45 | R15.2 13.65,25.4 13.65,23.5 Q1.2 | Q1.2 13.34,23.18 9.84,19.68 9.84,14.29 JP4.7
N$9
  Bottom 0.152: 24.96,35.89 R18.2 25.08,35.88 25.08,40.96 T1.B
N$10
  Top 0.152: R22.2 14.1,62.86 13.59,63.37 6.91,63.37 4.51,60.96 2.92,60.96 ESP01_1.3
N$11
  Top 0.152: 84.84,56.54 Q3.2 83.79,56.45 83.44,56.8 R11.2 | JP5.3 73,41.15 74.02,42.16 74.02,45.16 81.66,52.81 81.66,54.62 83.44,56.4 R11.2 | 83.39,57.28 R11.2
N$12
  Top 0.152: JP5.5 70.64,40.92 70.64,47.73 79.44,56.53 Q4.2 80.07,57.09 80.27,57.28 R12.2
N$13
  Top 0.152: ESP01_.3 19.58,75.87 17.85,75.87 16.51,74.53 R23.1
N$17
  Top 0.152: T2.C 86.91,42.09 R9.1
RST2
  Top 0.152: ESP01_1.5 2.92,58.42 4.32,58.42 7.11,61.21 ESPRST.2 9.64,59.19 R20.1
RXD2RD
  Top 0.152: ESP01_.8 28.3,74.78 J1.12
RXDESP
  Top 0.152: J2_XME.23 | J2_XME.23 87.09,47.24 76.98,37.13 72.67,37.13 71.98,36.45 71.98,29.82 73.89,27.91 73.89,25.81 73.57,25.5 69.79,25.5 69.32,25.97 69.32,27.03 68.74,27.61 61.72,27.61 60.73,26.62 ESP01_3.8
SCK
  Bottom 0.152: 3D_ACC.3 18.1,6.35 19.37,5.08 24.13,5.08 24.13,45.72 SPI0.3
SDI
  Bottom 0.152: 3D_ACC.4 20.64,6.67 23.18,9.21 23.18,47.31 24.13,48.26 SPI0.4
SDO
  Bottom 0.152: 3D_ACC.7 27.94,6.35 26.35,4.76 18.2,4.76 16.83,6.13 16.83,17.14 22.23,22.54 22.23,45.4 21.91,45.72 SPI0.1
SENSIN
  Top 0.152: XDHT11.2 40.32,14.92 38.1,12.7 5.08,12.7 4.13,11.75 J3.12
TRIG
  Bottom 0.152: 19.07,23.72 Q6.3 19.05,23.5 21.91,23.5 21.91,37.15 20.32,38.73 17.14,38.73 17.14,37.78 SR04.2 17.14,37.47 17.14,33.02 18.41,31.75 R5.1
TRIGOUT
  Bottom 0.152: J3.10 5.58,12.51 5.58,10.37 JP4.4
TXD3RD
  Top 0.152: ESP01_.1 18.24,73.2 J1.6
TXDESP  (via drill 0.35)
  Top 0.152: J2_XME.27 94.79,42.16 94.06,41.43 94.06,39.62 92.69,38.25 80.44,38.25 76.68,34.49 76.68,26.19 73.97,23.47 v73.76,23.47
  Bottom 0.152: ESP01_3.1 70.05,29.16 70.92,28.3 70.92,25.2 71.73,24.38 72.85,24.38 v73.76,23.47
URXD
  Bottom 0.152: ESP01.8 15.28,44.59 11.18,44.59 10.58,43.98 10.58,42.72 6.65,38.79 6.65,27.07 5.18,25.6 5.18,22.96 4.06,21.84 J3.4
UTXD
  Bottom 0.152: ESP01.1 8.23,43.54 5.84,41.15 5.84,27.5 2.73,24.39 2.73,23.05 1.52,21.84 J3.3
VCC2
  Top 0.152: ESP01_1.7 2.64,53.62 7.38,53.62 10.54,56.78 R21.2 14.68,57.36 14.68,59.61 R20.2 R22.1
VCC3RD
  Top 0.152: ESP01_.7 25.85,74.68 24.59,75.94 24.59,77.86 23.93,78.51 18,78.51 16.2,76.72 R23.2 15.95,75.53 15.34,74.92 15.34,71.02 J1.2
W1
  Top 0.152: J2_XME.37 93.53,26.98 93.53,12.61 93.12,12.19 DHT11.2
X3DINT
  Top 0.152: JP5.8 76.45,36.07 86.87,46.48 94.93,46.48 95.44,45.97 97.29,45.97 J2_XME.26
X3DIRQ
  Top 0.152: JP8.8 80.9,39.37 76.05,34.52 76.05,31.93 75.56,31.45 73.2,31.45 72.72,31.93 72.72,35.84 JP5.7
X3V  (via drill 0.35)
  Top 0.152: 84.99,58.22 Q3.1 | 84.84,58.37 Q3.1 | DHT11.1 90.07,9.65 89.56,10.16 89.56,20.88 90.27,21.59 JP8.1 | 84.79,58.41 Q3.1 | J2_XME.3 94.59,71.22 71.01,71.22 70.48,70.69 70.48,51.91 71.12,51.28 73.64,51.28 78.14,55.78 78.14,56.45 78.17,56.48 Q4.1 78.74,56.53 80.5,58.28 R12.1 | Q3.1 84.72,58.23 83.5,58.23 R11.1 R12.1 | 79.25,2.01 I2CG.2 79.3,1.45 79.3,8.94 I2CV.1 79.5,9.3 77.83,10.97 77.83,20.83 77.32,21.34 71.63,21.34 | v71.25,45.29 71.25,47.79 77.93,54.48 R10.1 80.44,54.48 80.66,54.7 Q2.1 81.35,55.18 82.62,56.45 82.62,58.28 R12.1 | 70.84,29.15 R1.1 | R1.1 70.77,29.17 | 71.63,21.34 70.66,21.34 66.78,25.22 60.5,25.22 59.61,26.11 59.61,28.07 ESP01_3.7 60.71,29.11 61.9,27.91 69.75,27.91 70.85,29.01 R1.1 | C1.1 71.63,22.01 71.63,21.34
  Bottom 0.152: v71.25,45.29 71.22,45.26 71.22,25.44 71.77,24.89 76.73,24.89 78.28,23.34 78.28,10.36 I2CV.1 80.28,8.37 89.39,8.37 DHT11.1
XCS0
  Top 0.152: J4.5 86.52,10.51 86.52,20.76 91.24,25.48 92.62,25.48 93.22,26.08 93.22,28.38 95.53,30.68 97.23,30.68 J2_XME.36
XCS3D
  Top 0.152: JP8.9 93.37,41.91 94.92,43.46 97.64,43.46 98.55,42.55 J2_XME.28
XECHO  (via drill 0.35)
  Top 0.152: Q3.3 86.6,57.15 86.6,54.41 R7.1 88.11,54.4 89.56,52.95 v89.56,52.38
  Bottom 0.152: v89.56,52.38 87.99,52.38 86.39,50.77 86.39,24.87 93.67,17.58 93.67,4.34 93.12,3.79 88.67,3.79 SR04_1.3
XECHOIN
  Top 0.152: JP5.4 80.11,41.15 89.84,50.88 97.1,50.88 J2_XME.20
XGND
  Top 0.152: JP8.10 90.87,45.53 T2.E | J2_XME.2 J2_XME.4 | J2_XME.42 J2_XME.41 | ESP01_3.2 68.33,25.4 70.39,23.33 C1.2 72.1,23.33 IRSENS.2 | DHT11.4 92.94,19.53 92.94,23.14 JP8.2 87.63,19.81 J4.6 88.66,10.91 88.66,8.97 85.02,5.33 SR04_1.4
  Bottom 0.152: I2CG.1 80.64,5.33 SR04_1.4 | J2_XME.41 95.76,24.13 JP8.2 90.96,25.12 90.96,43.46 JP8.10 | BC2.2 72.9,71.37 72.9,56.13 J1FT.4 74.6,55.29 89.66,55.29 90.77,54.18 90.77,45.63 JP8.10 | J4.6 86.6,10.91 80.28,10.91 I2CV.2 80.49,12.68 80.49,21.61 IRSENS.2 | J2_XME.4 99.54,71.65 99.54,50.77 J2_XME.22 97.06,48.29 97.06,39.27 96.42,38.63 95.6,38.63 93.34,40.89 93.34,43.05 JP8.10
  pour Bottom: 70.48,76.45 99.06,76.45 99.82,75.69 99.82,0 54.86,0 53.85,1.02 53.85,32.56 69.85,32.56 69.85,75.82
XIR_OUT
  Top 0.152: Q2.3 82.66,53.33 74.45,45.12 74.45,38.27 73.69,37.52 72.52,37.52 71.68,36.68 71.68,29.62 72.9,28.4 IRSENS.1 | Q2.3 83.07,54.23 | Q2.3 82.83,54.4 R8.1
XIRIN
  Top 0.152: J2_XME.19 96.01,52.27 94.94,51.21 89.69,51.21 82.17,43.69 JP5.2
  Bottom 0.152: 75.44,43.74 JP5.2
XIROUT
  Top 0.152: J2_XME.25 94.04,44.7 92.39,43.05 90.37,43.05 89.4,42.09 R3.1
XME5V  (via drill 0.35)
  Top 0.152: BC2.1 J2_XME.1 97.03,75.18 97.23,74.98 97.23,72.24 98.15,71.32 99.06,71.32 99.67,70.71 99.67,56.87 98.91,56.11 98.02,56.11 97.31,55.4 97.31,54.38 96.73,53.8 93.5,53.8 93.02,53.31 91.42,53.31 90.68,52.58 90.68,52.07 90.15,51.56 86.87,51.56 | v78,44.6 82.62,44.6 86.87,48.85 86.87,51.56 | R8.2 R6.2 R7.2 86.87,53.15 86.87,51.56
  Bottom 0.152: BC2.1 74.17,72.64 J1FT.1 | SR04_1.1 92.2,10.13 91.52,10.82 90.07,10.82 89.15,11.73 89.15,15.24 77.98,26.42 IRSENS.3 78,26.68 78,29.67 | v78,44.6 78,29.67 | D1.A 77.7,29.97 78,29.67
XSCK
  Top 0.152: J4.3 85.62,9.4 86.18,9.96 86.18,20.95 91.9,26.67 JP8.3 92.05,26.67 92.05,27.74 96.01,31.7 J2_XME.35
XSCL
  Top 0.152: I2CV.3 80.57,14.22 81.01,13.79 81.01,8.93 81.79,8.15 I2CG.3 82.91,0.28 93.48,0.28 93.88,0.68 93.88,26.72 95.45,28.3 97.38,28.3 J2_XME.38
XSDA
  Top 0.152: J2_XME.33 96.01,34.16 92.35,30.5 91.64,30.5 90.47,29.34 90.47,26.29 80.95,16.76 I2CV.4 82.04,16.76 83.94,14.86 83.94,8.38 83.45,7.89 83.45,3.81 84.34,2.92 I2CG.4
XSDI
  Top 0.152: J4.4 85.06,11.96 85.06,20.3 90.81,26.04 90.81,28.07 JP8.4 91.95,29.47 95.75,33.27 97.28,33.27 J2_XME.34
XSDO
  Top 0.152: J4.1 81.41,10.54 81.41,14.12 80.03,15.49 78.76,15.49 78.33,15.92 78.33,17.27 79.15,18.09 80.74,18.09 89.51,26.73 90.17,27.39 90.17,34.02 91.54,35.38 95.45,35.38 95.68,35.61 98.6,35.61 | 98.58,35.59 98.6,35.61 | 98.6,35.61 99.54,36.55 99.54,38.63 J2_XME.30
  Bottom 0.152: JP8.7 94.36,36.83 95.6,38.08 97,38.08 J2_XME.30
XTRIG  (via drill 0.35)
  Top 0.152: 85.4,58.98 79.52,58.98 79.12,58.58 Q4.3 | 85.4,58.98 85.56,58.82 85.56,54.61 R6.1 | v89.41,54.69 89.41,56.59 87.02,58.98 85.4,58.98
  Bottom 0.152: v89.41,54.69 85.98,51.26 85.98,24.82 93.32,17.48 93.32,4.42 92.99,4.09 91.01,4.09 89.76,5.33 SR04_1.2
XTRIGOUT
  Top 0.152: JP5.6 78,38.61 87.95,48.56 97.75,48.56 98.55,47.75 J2_XME.24

### Text on the board
tPlace: V | V G | by Edge | c6 c4 c2 c0 G / JA1 c5 c3 c1 G | by Edge | by Edge | d0 d1 / d2 d3 / d4 d5 / d6 d7 | 09-2020 | VCC | 09-2020 | G d1 d3 d5 d7 / G d0 d2 d4 d6 | 1 IR SENS / 2 ECHO / 3 TRIGG / 4 3D_INT | c1 c0 / c3 c2 / c6 c4 / ja1 c5 | RXD / / VCC | SDI GND / SDO SCK CS | 4 IR_IN / 3 ECHO / 2 TRIG / 1 3DINT | SDI GND / SDO SCK CSO | 09-2020 | by Edge30
bPlace: 09-2020 | by Edge | PMOD adapter / / / RX GPO0 GPO2 G / / VCC TX | 09-2020 | by Edge | 09-2020